# Altium schematic sheet Config.SchDoc: Config
size 127 x 127 mm; SheetNumber: 7; SheetTotal: 8
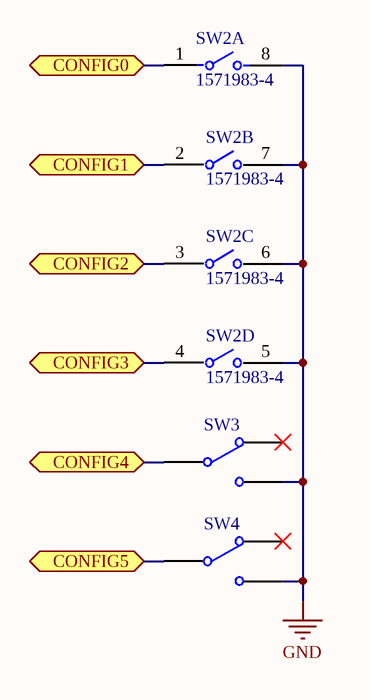
[diagram p0: Config.SchDoc]

## Parts
SW2  1571983-4  [FP-1571983-4-MFG]  (parts A,B,C,D of 4)
SW3  450404015514  [450404015514]  (value not drawn)
SW4  450404015514  [450404015514]  (value not drawn)

## Ports
CONFIG0 (bidir, see Microcontroller[2C]), CONFIG1 (bidir, see Microcontroller[2C]), CONFIG2 (bidir, see Microcontroller[2C]), CONFIG3 (bidir, see Microcontroller[2D]), CONFIG4 (bidir, see Microcontroller[2D]), CONFIG5 (bidir, see LevelShifter[2B])

## Nets
GND: SW2.5 SW2.6 SW2.7 SW2.8 SW3.L2 SW4.L2
CONFIG0: SW2.1 ; port CONFIG0
CONFIG1: SW2.2 ; port CONFIG1
CONFIG2: SW2.3 ; port CONFIG2
CONFIG3: SW2.4 ; port CONFIG3
CONFIG4: SW3.COM ; port CONFIG4
CONFIG5: SW4.COM ; port CONFIG5

Not connected (* = marked no-connect by the designer): SW3 L1*; SW4 L1*

## Library data of the parts
SW2 = CMP-03400-000014-1: SWITCH SLIDE DIP SPST 25MA 24V; Manufacturer: TE Connectivity; Standoff Height: 0.1mm; Electromechanical Life: 1000Cycles; Number Of Circuits: 4; Contact Resistance: 100mΩ; ComponentLink2URL: https://www.te.com/commerce/DocumentDelivery/DDEController?Action=showdoc&DocId=Customer+Drawing%7F1571983%7FC6%7Fpdf%7FEnglish%7FENG_CD_1571983_C6.pdf%7F1571983-4; Throw Configuration: SPST; Device Class L1: Electromechanical; Lead Free: Yes; Temperature Range Low: -30°C; Temperature: -30°C to +85°C; Octopart: https://octopart.com/1571983-4-te+connectivity-46507521; Temperature Range High: +85°C; Package: 1571983-4; Height: 2.56mm; Manufacturer Part Number: 1571983-4; Contact Current Rating: 25mA; ComponentLink2Description: Datasheet; Device Class L3: DIP Switches; Category: Switch; Device Class L2: Switches; RoHS: TRUE; Voltage Rating Dc: 24V; Digikey Description: SWITCH SLIDE DIP SPST 25MA 24V; Automotive: No
SW3 SW4 = CMP-03913-99472344-1: 450404015514 Slide Switch, 0.3A, 5Vdc, Smd Rohs Compliant: Yes; Current Rating: 300mA; Insulation Resistance: 100MΩ; Voltage Rating: 5V; NexarPartId: 99472344; Min Operating Temperature: -40°C; Contact Plating: Silver; Packaging: Tape and Reel; Max Operating Temperature: 85°C; RoHS: Compliant